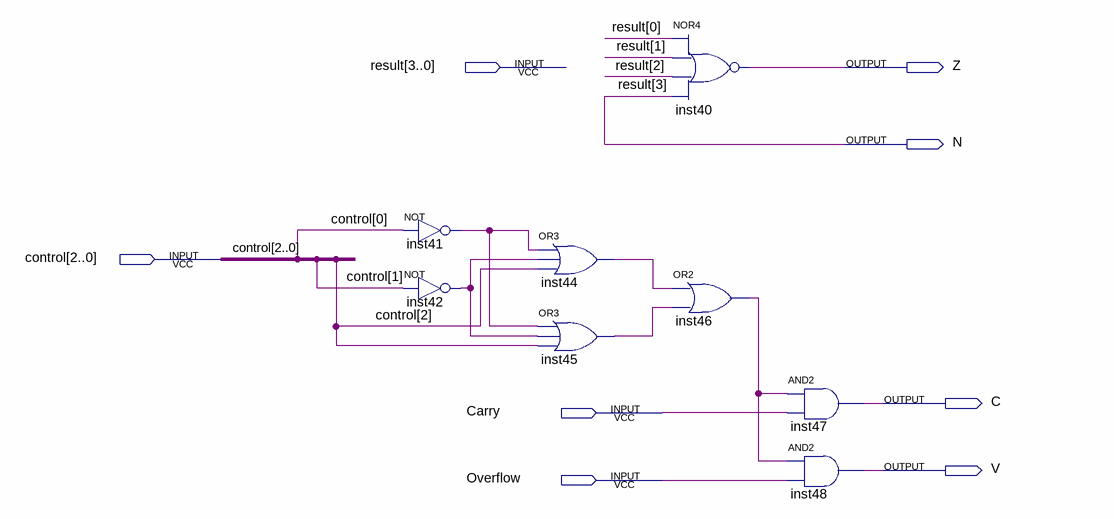
[diagram p0: schematic sheet]
// Quartus schematic flags_alu.bdf as structural Verilog: 8 symbols, 8 pins
module flags_alu (
  input  [3:0] result,
  input  [2:0] control,
  input  Carry,
  input  Overflow,
  output Z,
  output N,
  output C,
  output V
);

  wire inst41_out, inst42_out, inst44_out, inst45_out, inst46_out;

  not inst41 (inst41_out, control[0]);
  not inst42 (inst42_out, control[1]);
  or inst44 (inst44_out, inst41_out, inst42_out, control[2]);
  or inst45 (inst45_out, inst41_out, inst42_out, control[2]);
  nor inst40 (Z, result[0], result[1], result[2], result[3]);
  or inst46 (inst46_out, inst44_out, inst45_out);
  and inst47 (C, inst46_out, Carry);
  and inst48 (V, inst46_out, Overflow);

  assign N = result[3];
endmodule
